# Altium schematic sheet um3Supply.SchDoc
size A4
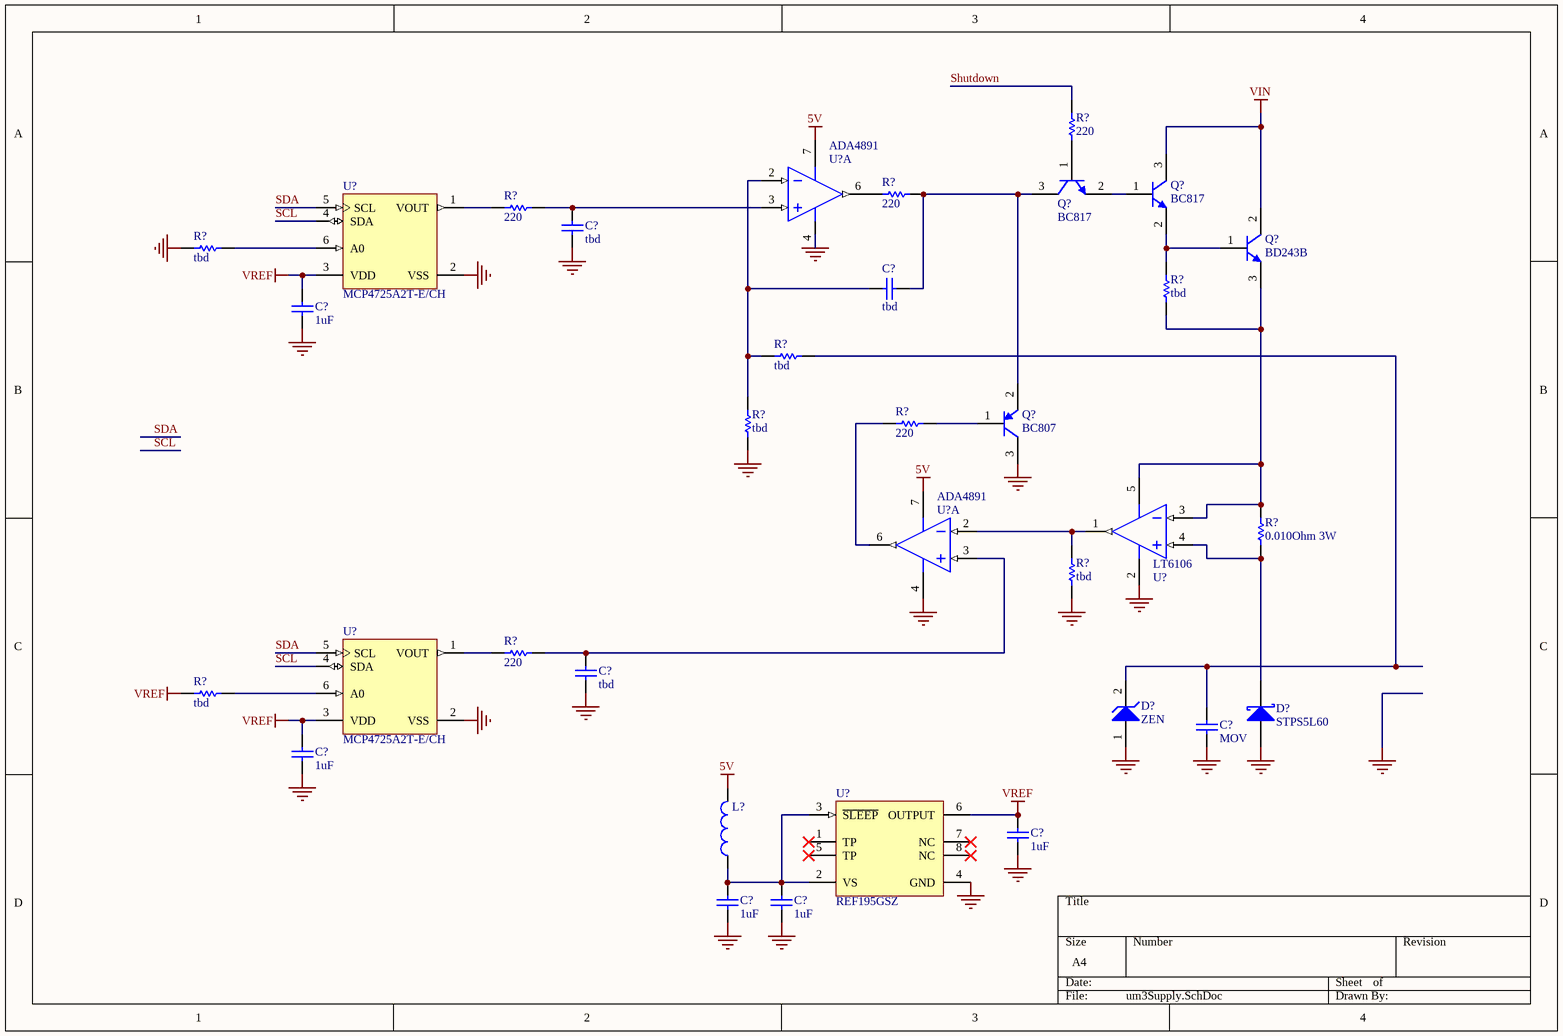
[diagram p0: um3Supply.SchDoc]

## Parts
(Parts that share a designator on the sheet are numbered #1, #2 ... from top to bottom, then left to right.)
C?#1  tbd  [CAPC0805(2012)100_L]
C?#2  tbd  [CAPC0805(2012)100_L]
C?#3  1uF  [CAPC0805(2012)100_L]
C?#4  tbd  [CAPC0805(2012)100_L]
C?#5  MOV  [CAPC2220(5750)230_N]
C?#6  1uF  [CAPC0805(2012)100_L]
C?#7  1uF  [CAPC0805(2012)100_L]
C?#8  1uF  [CAPC0805(2012)100_L]
C?#9  1uF  [CAPC0805(2012)100_L]
D?#1  ZEN  [STM-SMC_V]
D?#2  STPS5L60  [STM-DO-201AD]
L?  FBMJ2125HM210NT  [INDC2013X105X50LL20T30]  (value not drawn)
Q?#1  BC817  [ONSC-SOT-23-3-318-08_V]
Q?#2  BC817  [ONSC-SOT-23-3-318-08_V]
Q?#3  BD243B  [ONSC-TO-220-3-221A-09]
Q?#4  BC807  [ONSC-SC-70-3-419-04_V]
R?#1  220  [RESC0805(2012)_L]
R?#2  220  [RESC0805(2012)_L]
R?#3  220  [RESC0805(2012)_L]
R?#4  tbd  [RESC0805(2012)_L]
R?#5  tbd  [RESC0805(2012)_L]
R?#6  tbd  [RESC0805(2012)_L]
R?#7  tbd  [RESC0805(2012)_L]
R?#8  220  [RESC0805(2012)_L]
R?#9  0.010Ohm 3W  [RESC2512(6432)_M]
R?#10  tbd  [RESC0805(2012)_L]
R?#11  220  [RESC0805(2012)_L]
R?#12  tbd  [RESC0805(2012)_L]
U?#1  ADA4891  [ADI-R-8_L]  (part A of 2)
U?#2  MCP4725A2T-E/CH  [SOT-23-CH6_L]
U?#3  LT6106  [LT-S5-5-TSOT-23_N]
U?#4  ADA4891  [ADI-R-8_L]  (part A of 2)
U?#5  MCP4725A2T-E/CH  [SOT-23-CH6_L]
U?#6  REF195GSZ  [ADI-R-8_N]

## Nets
5V: L?.2 U?#1.7(+VS) U?#4.7(+VS)
GND: C?#1.1 C?#3.1 C?#4.1 C?#5.1 C?#6.1 C?#7.1 C?#8.1 C?#9.1 D?#1.1(A) D?#2.2(A) Q?#4.3(C) R?#4.1 R?#7.2 R?#10.1 U?#1.4(-VS) U?#2.2(VSS) U?#3.2(V-) U?#4.4(-VS) U?#5.2(VSS) U?#6.4(GND)
VIN: Q?#2.3(C) Q?#3.2(C)
VREF: C?#3.2 C?#6.2 C?#7.2 R?#12.1 U?#2.3(VDD) U?#5.3(VDD) U?#6.6(OUTPUT)
SCL: U?#2.4(SDA) U?#5.4(SDA)
SDA: U?#2.5(SCL) U?#5.5(SCL)
Shutdown: R?#1.2
NetC?#1_2: C?#1.2 R?#3.2 U?#1.3(+IN)
NetC?#2_1: C?#2.1 Q?#1.3(C) Q?#4.2(E) R?#2.2
NetC?#2_2: C?#2.2 R?#6.1 R?#7.1 U?#1.2(-IN)
NetC?#4_2: C?#4.2 R?#11.2 U?#4.3(+IN)
NetC?#5_2: C?#5.2 D?#1.2(K) R?#6.2
NetC?#8_2: C?#8.2 C?#9.2 L?.1 U?#6.2(VS) U?#6.3(~{SLEEP})
NetD?#2_1: D?#2.1(K) R?#9.1 U?#3.4(+IN)
NetQ?#1_1: Q?#1.1(B) R?#1.1
NetQ?#1_2: Q?#1.2(E) Q?#2.1(B)
NetQ?#2_2: Q?#2.2(E) Q?#3.1(B) R?#5.2
NetQ?#3_3: Q?#3.3(E) R?#5.1 R?#9.2 U?#3.3(-IN) U?#3.5(V+)
NetQ?#4_1: Q?#4.1(B) R?#8.1
NetR?#2_1: R?#2.1 U?#1.6(OUT)
NetR?#3_1: R?#3.1 U?#2.1(VOUT)
NetR?#4_2: R?#4.2 U?#2.6(A0)
NetR?#8_2: R?#8.2 U?#4.6(OUT)
NetR?#10_2: R?#10.2 U?#3.1(OUT) U?#4.2(-IN)
NetR?#11_1: R?#11.1 U?#5.1(VOUT)
NetR?#12_2: R?#12.2 U?#5.6(A0)

Not connected (* = marked no-connect by the designer): U?#6 1(TP)* 5(TP)* 7(NC)* 8(NC)*

## Library data of the parts
C?#1-C?#4 C?#6-C?#9 = CMP-1036-04734-1: CAP 1uF 6.3V ±20% 0805 (2012 Metric) Thickness 1mm SMD; Tolerance: Â±20%; Case-Metric: 2012; Case-EIA: 0805; Max Thickness: 1 mm; Technology: SMT; Rated Voltage: 6.3 V; Value: 1uF
C?#5 = CMP-1042-00392-1: Value: 22nF; Case-EIA: 2220; Tolerance: Â±20%; Rated Voltage: 200 V; Case-Metric: 5750; Max Thickness: 2.3 mm; Technology: SMT
D?#1 = CMP-0433-00001-1: PartNumber: SMCJ5.0A-TR; Manufacturer: STMicroelectronics; Junction Temperature: -55 to 150 degC; DatasheetVersion: Rev. 8, 07/2010; ComponentLink1URL: http://www.st.com; ComponentLink2Description: Datasheet; Mounting Technology: Surface Mount; PackageReference: SMC; PackageDescription: 2-Pin C-Bend SMT Diode, 7.9 x 5.9 mm Body; ComponentLink2URL: http://www.st.com/st-web-ui/static/active/en/resource/technical/document/datasheet/CD00001367.pdf; ComponentLink1Description: Manufacturer URL
D?#2 = CMP-2000-05365-1: Power Schottky rectifier, 60 V, 5 A, 2-Pin DO-201AD, RoHS, Cut Tape; Manufacturer: STMicroelectronics; Other Related Documents: STPS5L60ViewAllSpecifications; Online Catalog: SchottkyDiode; Current - Average Rectified (Io): 5A; Speed: FastRecovery=200mA(Io); Current - Reverse Leakage @ Vr: 220µA@60V; Other Names: 497-12673-3STPS5L60-ND; Voltage - DC Reverse (Vr) (Max): 60V; Voltage - Forward (Vf) (Max) @ If: 520mV@5A; Package Description: 2-Pin Axial Lead, Dia 5.3 mm, Body Length 9.5 mm; Datasheet Version: Rev. 3, 05/2008; Datasheet URL: http://download.siliconexpert.com/pdfs/2012/8/10/13/5/5/781/st_/manual/cd00002924.pdf; Operating Temperature - Junction: 150degC(Max); Capacitance @ Vr, F: -; Manufacturer URL: http://www.st.com/; Standard Package: 600; Diode Type: Schottky; Package Reference: DO-201AD; Category: DiscreteSemiconductorProducts; Package / Case: DO-201AD,Axial; Family: Diodes,Rectifiers-Single; Packaging: Tape&Box(TB); Supplier Device Package: DO-201AD; Reverse Recovery Time (trr): -; Package URL: http://download.siliconexpert.com/pdfs/2012/8/10/13/5/5/781/st_/manual/cd00002924.pdf; Mounting Type: ThroughHole; Series: -
L? = CMP-1660-00003-1: Chip Inductor, 21 Ohm, +/- 30%, 6 A, -40 to 125 degC, 0805 (2012 Metric), RoHS, Tape and Reel; Core Material: Ferrite; Current Rating: 6 A; Resistance: 4 mohm; Case\Package: 0805; Impedance: 21 Ohm; Min Operating Temperature: -40 degC; Width: 1.25 mm; PackageDescription: 2-Pin Surface Mount Device, Body 2 x 1.25 mm; Mounting Technology: Surface Mount; Package Quantity: 1; DatasheetVersion: 08/2016; Tolerance: 30%; Mount: Surface Mount; Max Operating Temperature: 125 degC; Height: 0.85 mm; ComponentLink1URL: http://www.t-yuden.com/; Case Code (Metric): 2012; ComponentLink1Description: Manufacturer URL; ComponentLink2URL: http://ds.yuden.co.jp/TYCOMPAS/ut/detail.do?productNo=FBMJ2125HM210NT&fileName=FBMJ2125HM210NT_SS&mode=specSheetDownload; Case Code (Imperial): 0805; Packaging: Tape and Reel; ComponentLink2Description: Datasheet; PackageReference: 0805; RoHSCompliant: true; Max Current Rating: 6 A; Length: 2 mm; REACH SVHC: Unknown
Q?#1 Q?#2 = CMP-1048-00736-1: General Purpose Transistor, NPN Silicon, 3-Pin SOT-23, Pb-Free, Tape and Reel; PartNumber: BC817-16LT1G; Manufacturer: On Semiconductor; IC Continuous (A): 0.5; fT Min (MHz): 100; Mounting Technology: Surface Mount; PackageVersion: Rev. AP, 11/2009; ComponentLink3Description: Package Specification; PackageReference: SOT-23-3-318-08; Packing: Tape and Reel; ComponentLink1URL: http://www.onsemi.com/; Polarity: NPN; RoHS: TRUE; ComponentLink2URL: http://www.onsemi.com/pub_link/Collateral/BC817-16LT1-D.PDF; ComponentLink3URL: http://www.onsemi.cn/pub_link/Collateral/318-08.PDF; ComponentLink2Description: Datasheet; PackageDescription: 3-Pin Small Outline Transistor, Body 2.92 x 1.3 mm, Pitch 0.95 mm; ComponentLink1Description: Manufacturer URL; DatasheetVersion: Rev. 12
Q?#3 = CMP-1048-01155-1: Complementary Silicon Plastic Power Transistor, 3-Pin TO-220, Tube; Manufacturer: On Semiconductor; Polarity: NPN; IC Continuous (A): 6; Note1: 0; fT Min (MHz): 3; DatasheetVersion: Rev. 14; PackageReference: TO-220-3-221A-09; RoHS: FALSE; Mounting Technology: Through Hole; PartNumber: BD243B; ComponentLink3URL: http://www.onsemi.com/pub_link/Collateral/221A-09.PDF; ComponentLink1Description: Manufacturer URL; Packing: Tube; PackageVersion: Rev. AG, 09/2011; ComponentLink1URL: http://www.onsemi.com/; ComponentLink3Description: Package Specification; PackageDescription: 3-Pin Flange Mount, Vertical Straight Lead, Body 9.97 x 4.445 mm, Pitch 2.54 mm; ComponentLink2Description: Datasheet; ComponentLink2URL: http://www.onsemi.com/pub_link/Collateral/BD243B-D.PDF
Q?#4 = CMP-1048-00340-1: General Purpose Transistor, PNP Silicon, 3-Pin SC70, Pb-Free, Tape and Reel; PartNumber: BC807-40WT3G; Manufacturer: On Semiconductor; Note1: 0; fT Min (MHz): 100; IC Continuous (A): -0.5; PackageReference: SC-70-3-419-04; RoHS: TRUE; PackageVersion: Rev. N, 11/2008; ComponentLink2Description: Datasheet; DatasheetVersion: Rev. 3; ComponentLink3URL: http://www.onsemi.cn/pub_link/Collateral/419-04.PDF; ComponentLink1URL: http://www.onsemi.com/; ComponentLink1Description: Manufacturer URL; PackageDescription: 3-Pin Small Outline Transistor, Body 2 x 1.25 mm, Pitch 0.65 mm; ComponentLink3Description: Package Specification; Mounting Technology: Surface Mount; Packing: Tape and Reel; Polarity: PNP; ComponentLink2URL: http://www.onsemi.com/pub_link/Collateral/BC807-25W-D.PDF
R?#1-R?#8 R?#10-R?#12 = CMP-1013-00397-1: Value: 100.00 Ohm; Power: 0.125 W; Case-Metric: 2012; Case-EIA: 0805; Tolerance: 1 %; Technology: SMT
R?#9 = CMP-1018-00955-1: Case-EIA: 2512; Case-Metric: 6432; Power: 1 W; Value: 8660000.00 Ohm; Tolerance: 1 %; Technology: SMT
U?#1 U?#4 = CMP-0384-01118-1: ADA4891-1ARZ-R7, Single Channel Single-Supply Operation Operational Amplifier, 240 MHz BW, 170 V/us SR, Industrial, 8-pin SOIC (R-8), Reel; Manufacturer: Analog Devices; Input Bias Current: 2pA; V Span Max: 5.5V; Iq/Amp: 4.4mA; Amplifiers Per Package: 1; Small Signal Bandwidth: 240MHz; Input Offset Voltage: 2.5mV; V Span Min: 2.7V; DatasheetVersion: Rev. D; Packing: Reel; ComponentLink1URL: http://www.analog.com/en/index.html; ComponentLink3Description: Package Specification; Generic Part Number: ADA4891-1; Code_JEDEC: MS-012-AA; Mounting Technology: Surface Mount; PartNumber: ADA4891-1ARZ-R7; PackageDescription: 8-Pin Standard Small Outline Package, Body 3.9 x 4.9 mm, Pitch 1.27 mm; Slew Rate: 170V/us; PackageReference: R-8; ComponentLink1Description: Manufacturer URL; ComponentLink3URL: http://www.analog.com/static/imported-files/packages/PKG_PDF/SOIC_Narrow%20(R)/R_8.pdf; ComponentLink2URL: http://www.analog.com/static/imported-files/data_sheets/ADA4891-1_4891-2_4891-3_4891-4.PDF; PackageVersion: 060506-A; ComponentLink2Description: Datasheet; PartId: 1
U?#2 U?#5 = CMP-0188-00758-2: 12-Bit Digital-to-Analog Converter with EEPROM Memory in SOT-23-6, 6-Pin SOT-23, Extended Temperature, Tape and Reel; PackageDescription: 6-Lead Plastic Small Outline Transistor (CH) [SOT-23]; ComponentLink1URL: http://www.microchip.com/; ComponentLink3URL: http://www.microchip.com/stellent/groups/techpub_sg/documents/packagingspec/en012702.pdf; ComponentLink2Description: Datasheet; PackageReference: SOT-23-CH6; DatasheetVersion: revD, Jun-2009; RevisionNote: URLs added.; Code_IPC: SOT26A-6; ComponentLink2URL: http://ww1.microchip.com/downloads/en/DeviceDoc/22039d.pdf; ComponentLink1Description: Manufacturer URL; ComponentLink3Description: Package Specification; PackageVersion: revBB, Aug-2009
U?#3 = CMP-0359-01871-1: LT6106CS5#TRPBF, Single Channel, Low Cost, High Side Current Sense Operational Amplifier, 0.2 MHz Typical GBW, 5-Pin SOT-23 (S5-5), Commercial, Pb-Free, Reel; Manufacturer: Linear Technology; Vos (mV) Guaranteed: 0.25; GBW (MHz) Typical: 0.2; Channels (#): 1; Is (mA) Typical: 0.06; Vs Min (V): 2.7; Vs Max (V): 36; Vos (mV) Typical: 0.15; Linear Technology Part Number: LT6106; PackageDescription: 5-Lead Plastic TSOT-23, Body 1.63 x 2.90 mm, Pitch 0.95 mm; ComponentLink2URL: http://cds.linear.com/docs/Packaging/SOT_5_05-08-1635.pdf; Mounting Technology: Surface Mount; ComponentLink1Description: Datasheet; ComponentLink1URL: http://cds.linear.com/docs/Datasheet/6106fa.pdf; DatasheetVersion: Rev. A; Packing: Reel; ComponentLink2Description: Package Specification; Code_JEDEC: MO-193; Type: CSA; PackageReference: LT-S5-5-TSOT-23; RoHS: Pb-Free; PartNumber: LT6106CS5#TRPBF
U?#6 = CMP-0784-00123-1: Manufacturer: Analog Devices; Ref Out TC (ppm/C): 10; Vout: 5V; Packing: Tube; ComponentLink1URL: http://www.analog.com/en/index.html; ComponentLink4Description: URL Link1; Mounting Technology: Surface Mount; PartNumber: REF195GSZ; Operating Temp Range: -40 to 85 degC; ComponentLink4URL: Product URL:http://www.analog.com/en/special-linear-functions/voltage-references/ref195/products/product.html; ComponentLink2Description: Datasheet; ComponentLink1Description: Manufacturer URL; DatasheetVersion: Rev. L; Code_JEDEC: MS-012-AA; ComponentLink3URL: http://www.analog.com/static/imported-files/packages/PKG_PDF/SOIC_Narrow%20(R)/R_8.pdf; ComponentLink3Description: Package Specification; PackageVersion: 060506-A, 06/2006; PackageReference: R-8; PackageDescription: 8-Pin Standard Small Outline Package, Body 4.9 x 3.9 mm, Pitch 1.27 mm; ComponentLink2URL: http://www.analog.com/static/imported-files/data_sheets/REF19xSeries.pdf